# Altium project TiSupervisoryController.PrjPcb
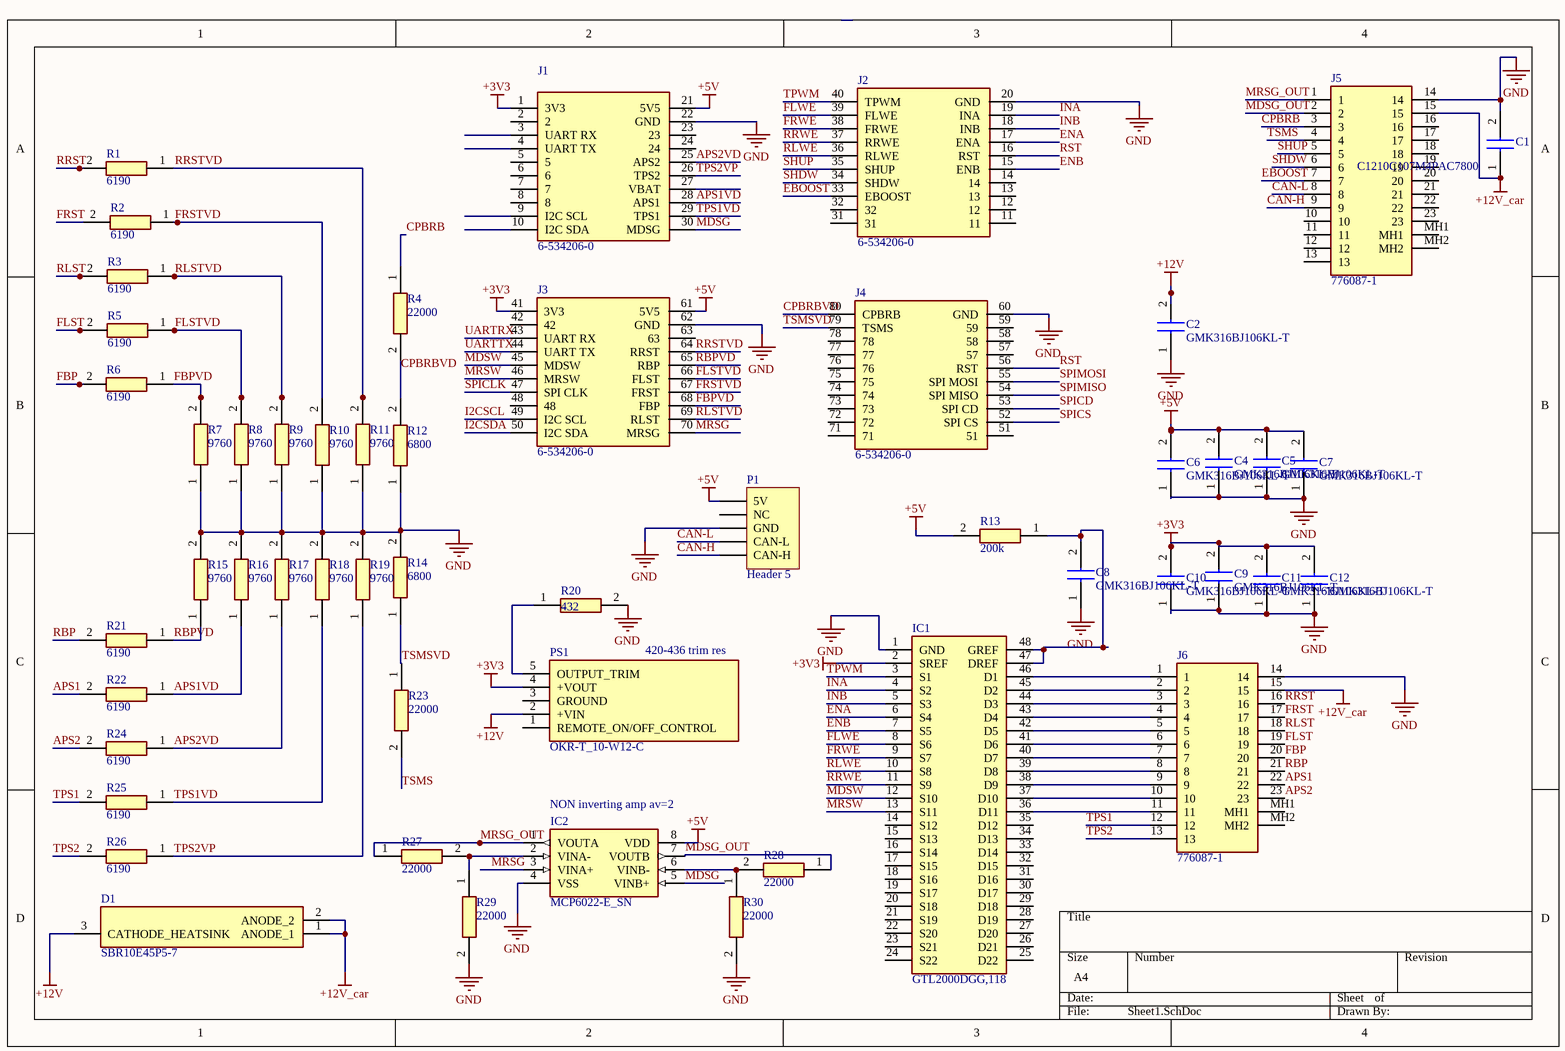
[diagram p0: Sheet1.SchDoc]
1 sheet, 52 parts. Net scope: global (net labels, ports and power ports of the same name join across sheets).
Board file: PCB1.PcbDoc

## Sheet Sheet1.SchDoc
size A4

### Parts
C1  C1210C107M4PAC7800  [CAPC3225X280N]
C2  GMK316BJ106KL-T  [CAPC3216X190N]
C4  GMK316BJ106KL-T  [CAPC3216X190N]
C5  GMK316BJ106KL-T  [CAPC3216X190N]
C6  GMK316BJ106KL-T  [CAPC3216X190N]
C7  GMK316BJ106KL-T  [CAPC3216X190N]
C8  GMK316BJ106KL-T  [CAPC3216X190N]
C9  GMK316BJ106KL-T  [CAPC3216X190N]
C10  GMK316BJ106KL-T  [CAPC3216X190N]
C11  GMK316BJ106KL-T  [CAPC3216X190N]
C12  GMK316BJ106KL-T  [CAPC3216X190N]
D1  SBR10E45P5-7  [POWERDI5]
IC1  GTL2000DGG,118  [SOP50P810X120-48N]
IC2  MCP6022-E_SN  [SOIC127P600X175-8N]
J1  6-534206-0  [206-0]
J2  6-534206-0  [206-0_1]
J3  6-534206-0  [206-0_2]
J4  6-534206-0  [206-0_3]
J5  776087-1  [7760871]
J6  776087-1  [7760871]
P1  Header 5  [HDR1X5]
PS1  OKR-T_10-W12-C  [OKRT10W12C]
R1  6190  [RESC3116X70N]
R2  6190  [RESC3116X70N]
R3  6190  [RESC3116X70N]
R4  22000  [RESC3116X70N]
R5  6190  [RESC3116X70N]
R6  6190  [RESC3116X70N]
R7  9760  [RESC3116X70N]
R8  9760  [RESC3116X70N]
R9  9760  [RESC3116X70N]
R10  9760  [RESC3116X70N]
R11  9760  [RESC3116X70N]
R12  6800  [RESC3116X70N]
R13  200k  [RESC3116X70N]
R14  6800  [RESC3116X70N]
R15  9760  [RESC3116X70N]
R16  9760  [RESC3116X70N]
R17  9760  [RESC3116X70N]
R18  9760  [RESC3116X70N]
R19  9760  [RESC3116X70N]
R20  432  [RESC3116X70N]
R21  6190  [RESC3116X70N]
R22  6190  [RESC3116X70N]
R23  22000  [RESC3116X70N]
R24  6190  [RESC3116X70N]
R25  6190  [RESC3116X70N]
R26  6190  [RESC3116X70N]
R27  22000  [RESC3116X70N]
R28  22000  [RESC3116X70N]
R29  22000  [RESC3116X70N]
R30  22000  [RESC3116X70N]

### Nets
+3V3: C9.2 C10.2 C11.2 C12.2 IC1.2(SREF) J1.1(3V3) J3.41(3V3) PS1.4(+VOUT)
+5V: C4.2 C5.2 C6.2 C7.2 IC2.8(VDD) J1.21(5V5) J3.61(5V5) P1.1(5V) R13.2
+12V: C2.2 D1.3(CATHODE_HEATSINK) PS1.2(+VIN)
+12V_car: C1.1 D1.1(ANODE_1) D1.2(ANODE_2) J5.15 J6.15
GND: C1.2 C2.1 C4.1 C5.1 C6.1 C7.1 C8.1 C9.1 C10.1 C11.1 C12.1 IC1.1(GND) IC2.4(VSS) J1.22(GND) J2.20(GND) J3.62(GND) J4.60(GND) J5.14 J6.14 P1.3(GND) R7.1 R8.1 R9.1 R10.1 R11.1 R12.1 R14.2 R15.2 R16.2 R17.2 R18.2 R19.2 R20.2 R29.2 R30.2
APS1: J6.22 R22.2
APS1VD: J1.28(APS1) R16.1 R22.1
APS2: J6.23 R24.2
APS2VD: J1.25(APS2) R17.1 R24.1
CAN-H: J5.9 P1.5(CAN-H)
CAN-L: J5.8 P1.4(CAN-L)
CPBRB: J5.3 R4.1
CPBRBVD: J4.80(CPBRB) R4.2 R12.2
EBOOST: J2.33(EBOOST) J5.7
ENA: IC1.6(S4) J2.17(ENA)
ENB: IC1.7(S5) J2.15(ENB)
FBP: J6.20 R6.2
FBPVD: J3.68(FBP) R6.1 R7.2
FLST: J6.19 R5.2
FLSTVD: J3.66(FLST) R5.1 R8.2
FLWE: IC1.8(S6) J2.39(FLWE)
FRST: J6.17 R2.2
FRSTVD: J3.67(FRST) R2.1 R10.2
FRWE: IC1.9(S7) J2.38(FRWE)
I2CSCL: J3.49(I2C_SCL)
I2CSDA: J3.50(I2C_SDA)
INA: IC1.4(S2) J2.19(INA)
INB: IC1.5(S3) J2.18(INB)
MDSG: IC2.5(VINB+) J1.30(MDSG)
MDSG_OUT: IC2.7(VOUTB) J5.2 R28.1
MDSW: IC1.12(S10) J3.45(MDSW)
MRSG: IC2.3(VINA+) J3.70(MRSG)
MRSG_OUT: IC2.1(VOUTA) J5.1 R27.1
MRSW: IC1.13(S11) J3.46(MRSW)
RBP: J6.21 R21.2
RBPVD: J3.65(RBP) R15.1 R21.1
RLST: J6.18 R3.2
RLSTVD: J3.69(RLST) R3.1 R9.2
RLWE: IC1.10(S8) J2.36(RLWE)
RRST: J6.16 R1.2
RRSTVD: J3.64(RRST) R1.1 R11.2
RRWE: IC1.11(S9) J2.37(RRWE)
RST: J2.16(RST) J4.56(RST)
SHDW: J2.34(SHDW) J5.6
SHUP: J2.35(SHUP) J5.5
SPICD: J4.53(SPI_CD)
SPICLK: J3.47(SPI_CLK)
SPICS: J4.52(SPI_CS)
SPIMISO: J4.54(SPI_MISO)
SPIMOSI: J4.55(SPI_MOSI)
TPS1: J6.12 R25.2
TPS1VD: J1.29(TPS1) R18.1 R25.1
TPS2: J6.13 R26.2
TPS2VP: J1.26(TPS2) R19.1 R26.1
TPWM: IC1.3(S1) J2.40(TPWM)
TSMS: J5.4 R23.2
TSMSVD: J4.79(TSMS) R14.1 R23.1
UARTRX: J3.43(UART_RX)
UARTTX: J3.44(UART_TX)
NetC8_2: C8.2 IC1.47(DREF) IC1.48(GREF) R13.1
NetIC1_36: IC1.36(D11) J6.11
NetIC1_37: IC1.37(D10) J6.10
NetIC1_38: IC1.38(D9) J6.9
NetIC1_39: IC1.39(D8) J6.8
NetIC1_40: IC1.40(D7) J6.7
NetIC1_41: IC1.41(D6) J6.6
NetIC1_42: IC1.42(D5) J6.5
NetIC1_43: IC1.43(D4) J6.4
NetIC1_44: IC1.44(D3) J6.3
NetIC1_45: IC1.45(D2) J6.2
NetIC1_46: IC1.46(D1) J6.1
NetIC2_2: IC2.2(VINA-) R27.2 R29.1
NetIC2_6: IC2.6(VINB-) R28.2 R30.1
NetPS1_5: PS1.5(OUTPUT_TRIM) R20.1

Not connected (* = marked no-connect by the designer): IC1 14(S12) 15(S13) 16(S14) 17(S15) 18(S16) 19(S17) 20(S18) 21(S19) 22(S20) 23(S21) 24(S22) 25(D22) 26(D21) 27(D20) 28(D19) 29(D18) 30(D17) 31(D16) 32(D15) 33(D14) 34(D13) 35(D12); J1 2 3(UART_RX) 4(UART_TX) 5 6 7 8 9(I2C_SCL) 10(I2C_SDA) 23 24 27(VBAT); J2 11 12 13 14 31 32; J3 42 48 63; J4 51 57 58 59 71 72 73 74 75 76 77 78; J5 10 11 12 13 16 17 18 19 20 21 22 23 MH1 MH2; J6 MH1 MH2; P1 2(NC); PS1 1(REMOTE_ON/OFF_CONTROL) 3(GROUND)

### Notes on the sheet
- 420-436 trim res
- (near IC2) NON inverting amp av=2

### Library data of the parts
C1 = C1210C107M4PAC7800: Capacitor; Manufacturer_Name: Kemet; Datasheet Link: https://content.kemet.com/datasheets/KEM_C1006_X5R_SMD.pdf; Height: 2.8mm; Manufacturer_Part_Number: C1210C107M4PAC7800; Mouser Part Number: N/A; Mouser Price/Stock: https://www.mouser.com/Search/Refine.aspx?Keyword=N%2FA
C2 C4-C12 = GMK316BJ106KL-T: Capacitor; Manufacturer_Name: TAIYO YUDEN; Datasheet Link: https://www.yuden.co.jp/productdata/catalog/en/mlcc_all_e.pdf; Height: 1.9mm; Manufacturer_Part_Number: GMK316BJ106KL-T; Mouser Part Number: 963-GMK316BJ106KL-T; Mouser Price/Stock: http://www.mouser.com/Search/ProductDetail.aspx?qs=I6KAKw0tg2wzwIZ%2fJjJ5Xg%3d%3d
D1 = SBR10E45P5-7: Schottky Diode; Manufacturer_Name: Diodes Inc.; Datasheet Link: https://www.diodes.com/assets/Datasheets/SBR10E45P5.pdf; Manufacturer_Part_Number: SBR10E45P5-7; Mouser Part Number: 621-SBR10E45P5-7; Mouser Price/Stock: https://www.mouser.com/Search/Refine.aspx?Keyword=621-SBR10E45P5-7
IC1 = GTL2000DGG,118: Integrated Circuit; Manufacturer_Name: Nexperia; Datasheet Link: https://www.nxp.com/docs/en/data-sheet/GTL2000.pdf; Height: 1.2mm; Manufacturer_Part_Number: GTL2000DGG,118; Mouser Part Number: 771-GTL2000DGG118; Mouser Price/Stock: https://www.mouser.com/Search/Refine.aspx?Keyword=771-GTL2000DGG118
IC2 = MCP6022-E_SN: Integrated Circuit; Manufacturer_Name: Microchip; Manufacturer_Part_Number: MCP6022-E/SN; Allied_Number: 70046166; Datasheet Link: http://ww1.microchip.com/downloads/en/DeviceDoc/21685d.pdf; Height: 1.75mm; Mouser Part Number: 579-MCP6022-E/SN; Mouser Price/Stock: https://www.mouser.com/Search/Refine.aspx?Keyword=579-MCP6022-E%2FSN; RS Part Number: 2508396144; RS Price/Stock: http://uk.rs-online.com/web/p/products/2508396144; Allied Price/Stock: http://www.alliedelec.com/microchip-technology-inc-mcp6022-e-sn/70046166/
J1 = 6-534206-0: Connector; Manufacturer_Name: TE Connectivity; Allied_Number: 70042958; Datasheet Link: https://www.te.com/commerce/DocumentDelivery/DDEController?Action=showdoc&DocId=Customer+Drawing%7F534206%7FR7%7Fpdf%7FEnglish%7FENG_CD_534206_R7.pdf%7F6-534206-0; Height: 8.64mm; Manufacturer_Part_Number: 6-534206-0; Mouser Part Number: 571-6-534206-0; Mouser Price/Stock: https://www.mouser.com/Search/Refine.aspx?Keyword=571-6-534206-0; RS Part Number: 6803445P; RS Price/Stock: http://uk.rs-online.com/web/p/products/6803445P; Allied Price/Stock: https://www.alliedelec.com/teconnectivity-6-534206-0/70042958/
J2 = 6-534206-0_1: Connector; Manufacturer_Name: TE Connectivity; Allied_Number: 70042958; Datasheet Link: https://www.te.com/commerce/DocumentDelivery/DDEController?Action=showdoc&DocId=Customer+Drawing%7F534206%7FR7%7Fpdf%7FEnglish%7FENG_CD_534206_R7.pdf%7F6-534206-0; Height: 8.64mm; Manufacturer_Part_Number: 6-534206-0; Mouser Part Number: 571-6-534206-0; Mouser Price/Stock: https://www.mouser.com/Search/Refine.aspx?Keyword=571-6-534206-0; RS Part Number: 6803445P; RS Price/Stock: http://uk.rs-online.com/web/p/products/6803445P; Allied Price/Stock: https://www.alliedelec.com/teconnectivity-6-534206-0/70042958/
J3 = 6-534206-0_2: Connector; Manufacturer_Name: TE Connectivity; Allied_Number: 70042958; Datasheet Link: https://www.te.com/commerce/DocumentDelivery/DDEController?Action=showdoc&DocId=Customer+Drawing%7F534206%7FR7%7Fpdf%7FEnglish%7FENG_CD_534206_R7.pdf%7F6-534206-0; Height: 8.64mm; Manufacturer_Part_Number: 6-534206-0; Mouser Part Number: 571-6-534206-0; Mouser Price/Stock: https://www.mouser.com/Search/Refine.aspx?Keyword=571-6-534206-0; RS Part Number: 6803445P; RS Price/Stock: http://uk.rs-online.com/web/p/products/6803445P; Allied Price/Stock: https://www.alliedelec.com/teconnectivity-6-534206-0/70042958/
J4 = 6-534206-0_3: Connector; Manufacturer_Name: TE Connectivity; Allied_Number: 70042958; Datasheet Link: https://www.te.com/commerce/DocumentDelivery/DDEController?Action=showdoc&DocId=Customer+Drawing%7F534206%7FR7%7Fpdf%7FEnglish%7FENG_CD_534206_R7.pdf%7F6-534206-0; Height: 8.64mm; Manufacturer_Part_Number: 6-534206-0; Mouser Part Number: 571-6-534206-0; Mouser Price/Stock: https://www.mouser.com/Search/Refine.aspx?Keyword=571-6-534206-0; RS Part Number: 6803445P; RS Price/Stock: http://uk.rs-online.com/web/p/products/6803445P; Allied Price/Stock: https://www.alliedelec.com/teconnectivity-6-534206-0/70042958/
J5 J6 = 776087-1: Connector; Manufacturer_Name: TE Connectivity; Allied_Number: 70288175; Datasheet Link: https://componentsearchengine.com/Datasheets/1/776087-1.pdf; Height: 32.1mm; Manufacturer_Part_Number: 776087-1; Mouser Part Number: 571-776087-1; Mouser Price/Stock: https://www.mouser.com/Search/Refine.aspx?Keyword=571-776087-1; RS Part Number: 7181471P; RS Price/Stock: http://uk.rs-online.com/web/p/products/7181471P; Allied Price/Stock: https://www.alliedelec.com/te-connectivity-776087-1/70288175/
P1 = Header 5: Header, 5-Pin; LatestRevisionDate: 17-Jul-2002; LatestRevisionNote: Re-released for DXP Platform.; Publisher: Altium Limited
PS1 = OKR-T_10-W12-C: Power Supply; Manufacturer_Name: Murata Electronics; Manufacturer_Part_Number: OKR-T/10-W12-C; Datasheet Link: https://componentsearchengine.com/Datasheets/2/OKR-T_10-W12-C.pdf; Height: 16.55mm; Mouser Part Number: 580-OKR-T/10-W12-C; Mouser Price/Stock: https://www.mouser.com/Search/Refine.aspx?Keyword=580-OKR-T%2F10-W12-C; RS Part Number: 1736947P; RS Price/Stock: http://uk.rs-online.com/web/p/products/1736947P
R1-R3 R5 R6 R21 R22 R24-R26 = ERJ-8ENF1000V: Resistor; Manufacturer_Name: Panasonic; Manufacturer_Part_Number: ERJ-8ENF6191V; Allied_Number: 70266166; Datasheet Link: https://industrial.panasonic.com/cdbs/www-data/pdf/RDA0000/AOA0000C86.pdf; Height: 0.7mm; Mouser Part Number: 667-ERJ-8ENF6191V; Mouser Price/Stock: https://www.mouser.com/Search/Refine.aspx?Keyword=667-ERJ-8ENF1000V; Allied Price/Stock: https://www.alliedelec.com/panasonic-erj-8enf1000v/70266166/
R4 R23 R27-R30 = ERJ-8ENF1000V: Resistor; Manufacturer_Name: Panasonic; Manufacturer_Part_Number: ERJ-8ENF2201V; Allied_Number: 70266166; Datasheet Link: https://industrial.panasonic.com/cdbs/www-data/pdf/RDA0000/AOA0000C86.pdf; Height: 0.7mm; Mouser Part Number: 667-ERJ-8ENF2201V; Mouser Price/Stock: https://www.mouser.com/Search/Refine.aspx?Keyword=667-ERJ-8ENF1000V; Allied Price/Stock: https://www.alliedelec.com/panasonic-erj-8enf1000v/70266166/
R7-R11 R15-R19 = ERJ-8ENF1000V: Resistor; Manufacturer_Name: Panasonic; Manufacturer_Part_Number: ERJ-8ENF9761V; Allied_Number: 70266166; Datasheet Link: https://industrial.panasonic.com/cdbs/www-data/pdf/RDA0000/AOA0000C86.pdf; Height: 0.7mm; Mouser Part Number: 667-ERJ-8ENF9761V; Mouser Price/Stock: https://www.mouser.com/Search/Refine.aspx?Keyword=667-ERJ-8ENF1000V; Allied Price/Stock: https://www.alliedelec.com/panasonic-erj-8enf1000v/70266166/
R12 R14 = ERJ-8ENF1000V: Resistor; Manufacturer_Name: Panasonic; Manufacturer_Part_Number: ERJ-8ENF6801V; Allied_Number: 70266166; Datasheet Link: https://industrial.panasonic.com/cdbs/www-data/pdf/RDA0000/AOA0000C86.pdf; Height: 0.7mm; Mouser Part Number: 667-ERJ-8ENF6801V; Mouser Price/Stock: https://www.mouser.com/Search/Refine.aspx?Keyword=667-ERJ-8ENF1000V; Allied Price/Stock: https://www.alliedelec.com/panasonic-erj-8enf1000v/70266166/
R13 = ERJ-8ENF1000V: Resistor; Manufacturer_Name: Panasonic; Manufacturer_Part_Number: ERJ-8ENF2003V; Allied_Number: 70266166; Datasheet Link: https://industrial.panasonic.com/cdbs/www-data/pdf/RDA0000/AOA0000C86.pdf; Height: 0.7mm; Mouser Part Number: 667-ERJ-8ENF2003V; Mouser Price/Stock: https://www.mouser.com/Search/Refine.aspx?Keyword=667-ERJ-8ENF1000V; Allied Price/Stock: https://www.alliedelec.com/panasonic-erj-8enf1000v/70266166/
R20 = ERJ-8ENF1000V: Resistor; Manufacturer_Name: Panasonic; Manufacturer_Part_Number: ERJ-8ENF4320V; Allied_Number: 70266166; Datasheet Link: https://industrial.panasonic.com/cdbs/www-data/pdf/RDA0000/AOA0000C86.pdf; Height: 0.7mm; Mouser Part Number: 667-ERJ-8ENF4320V; Mouser Price/Stock: https://www.mouser.com/Search/Refine.aspx?Keyword=667-ERJ-8ENF1000V; Allied Price/Stock: https://www.alliedelec.com/panasonic-erj-8enf1000v/70266166/